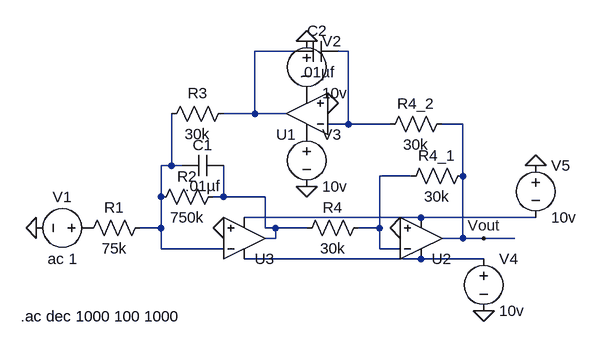
[diagram p0: schematic Biquad.asc]
Biquad.asc, the LTspice schematic file:
Version 4
SHEET 1 1128 680
WIRE 208 48 144 48
WIRE 288 48 272 48
WIRE 144 144 144 48
WIRE 144 144 96 144
WIRE 192 144 144 144
WIRE 288 160 288 48
WIRE 288 160 256 160
WIRE 352 160 288 160
WIRE 464 160 432 160
WIRE 16 224 16 144
WIRE 16 224 0 224
WIRE 32 224 16 224
WIRE 384 240 336 240
WIRE 464 240 464 160
WIRE 0 272 0 224
WIRE 96 272 96 224
WIRE 96 272 80 272
WIRE 160 272 96 272
WIRE 400 304 128 304
WIRE 576 304 400 304
WIRE 0 320 0 272
WIRE 0 320 -32 320
WIRE 160 320 160 272
WIRE 176 320 160 320
WIRE 224 320 176 320
WIRE 336 320 336 240
WIRE 336 320 304 320
WIRE 176 336 176 320
WIRE 176 336 160 336
WIRE 464 336 464 240
WIRE 464 336 432 336
WIRE 496 336 464 336
WIRE 544 336 496 336
WIRE 0 352 0 320
WIRE 96 352 0 352
WIRE 336 352 336 320
WIRE 368 352 336 352
WIRE 400 368 128 368
WIRE 496 368 400 368
FLAG -192 320 0
FLAG 256 128 0
FLAG 96 320 0
FLAG 224 256 0
FLAG 224 32 0
FLAG 496 448 0
FLAG 576 224 0
FLAG 368 320 0
FLAG 496 336 Vout
SYMBOL OpAmps\\UniversalOpamp2 224 144 R180
SYMATTR InstName U1
SYMBOL OpAmps\\UniversalOpamp2 400 336 M180
SYMATTR InstName U2
SYMBOL OpAmps\\UniversalOpamp2 128 336 M180
SYMATTR InstName U3
SYMBOL res 448 144 R90
WINDOW 0 0 56 VBottom 2
WINDOW 3 32 56 VTop 2
SYMATTR InstName R4_2
SYMATTR Value 30k
SYMBOL res 480 224 R90
WINDOW 0 0 56 VBottom 2
WINDOW 3 32 56 VTop 2
SYMATTR InstName R4_1
SYMATTR Value 30k
SYMBOL cap 96 208 R90
WINDOW 0 0 32 VBottom 2
WINDOW 3 32 32 VTop 2
SYMATTR InstName C1
SYMATTR Value .01µf
SYMBOL res 96 256 R90
WINDOW 0 0 56 VBottom 2
WINDOW 3 32 56 VTop 2
SYMATTR InstName R2
SYMATTR Value 750k
SYMBOL res -16 304 R90
WINDOW 0 0 56 VBottom 2
WINDOW 3 32 56 VTop 2
SYMATTR InstName R1
SYMATTR Value 75k
SYMBOL res 320 304 R90
WINDOW 0 0 56 VBottom 2
WINDOW 3 32 56 VTop 2
SYMATTR InstName R4
SYMATTR Value 30k
SYMBOL voltage -96 320 R90
WINDOW 0 -32 56 VBottom 2
WINDOW 3 32 56 VTop 2
SYMATTR InstName V1
SYMATTR Value ac 1
SYMBOL res 112 128 R90
WINDOW 0 0 56 VBottom 2
WINDOW 3 32 56 VTop 2
SYMATTR InstName R3
SYMATTR Value 30k
SYMBOL cap 272 32 R90
WINDOW 0 0 32 VBottom 2
WINDOW 3 32 32 VTop 2
SYMATTR InstName C2
SYMATTR Value .01µf
SYMBOL voltage 224 16 R0
WINDOW 123 0 0 Left 0
WINDOW 39 0 0 Left 0
SYMATTR InstName V2
SYMATTR Value 10v
SYMBOL voltage 224 160 R0
WINDOW 123 0 0 Left 0
WINDOW 39 0 0 Left 0
SYMATTR InstName V3
SYMATTR Value 10v
SYMBOL voltage 496 352 R0
WINDOW 123 0 0 Left 0
WINDOW 39 0 0 Left 0
SYMATTR InstName V4
SYMATTR Value 10v
SYMBOL voltage 576 208 R0
WINDOW 123 0 0 Left 0
WINDOW 39 0 0 Left 0
SYMATTR InstName V5
SYMATTR Value 10v
TEXT -216 456 Left 2 !.ac dec 1000 100 1000

The netlist it stands for:
* Biquad.asc
XU1 0 N002 P001 P002 N001 level.2 Avol=1Meg GBW=10Meg Slew=10Meg ilimit=25m rail=0 Vos=0 phimargin=45 en=0 enk=0 in=0 ink=0 Rin=500Meg  ; pins IN+ IN- V+ V- OUT
XU2 0 N004 N007 N006 Vout level.2 Avol=1Meg GBW=10Meg Slew=10Meg ilimit=25m rail=0 Vos=0 phimargin=45 en=0 enk=0 in=0 ink=0 Rin=500Meg  ; pins IN+ IN- V+ V- OUT
XU3 0 N003 N007 N006 N005 level.2 Avol=1Meg GBW=10Meg Slew=10Meg ilimit=25m rail=0 Vos=0 phimargin=45 en=0 enk=0 in=0 ink=0 Rin=500Meg  ; pins IN+ IN- V+ V- OUT
R4_2 Vout N002 30k
R4_1 Vout N004 30k
C1 N005 N003 .01µf
R2 N005 N003 750k
R1 N003 P003 75k
R4 N004 N005 30k
V1 P003 0 ac 1
R3 N001 N003 30k
C2 N002 N001 .01µf
V2 0 P002 10v
V3 P001 0 10v
V4 N007 0 10v
V5 0 N006 10v
.ac dec 1000 100 1000
.lib UniversalOpamps2.sub
.backanno
.end